# EAGLE design rain-drop-probe-v1.1 (EAGLE 9.6.2)
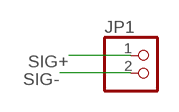
[diagram p0: schematic, sheet 1]

## Parts
JP1  PINHD-1X2  [1X02]

## Nets
SIG+: JP1.1
SIG-: JP1.2

## Library data of the parts
JP1 = pinhead:PINHD-1X2: PIN HEADER

## Board
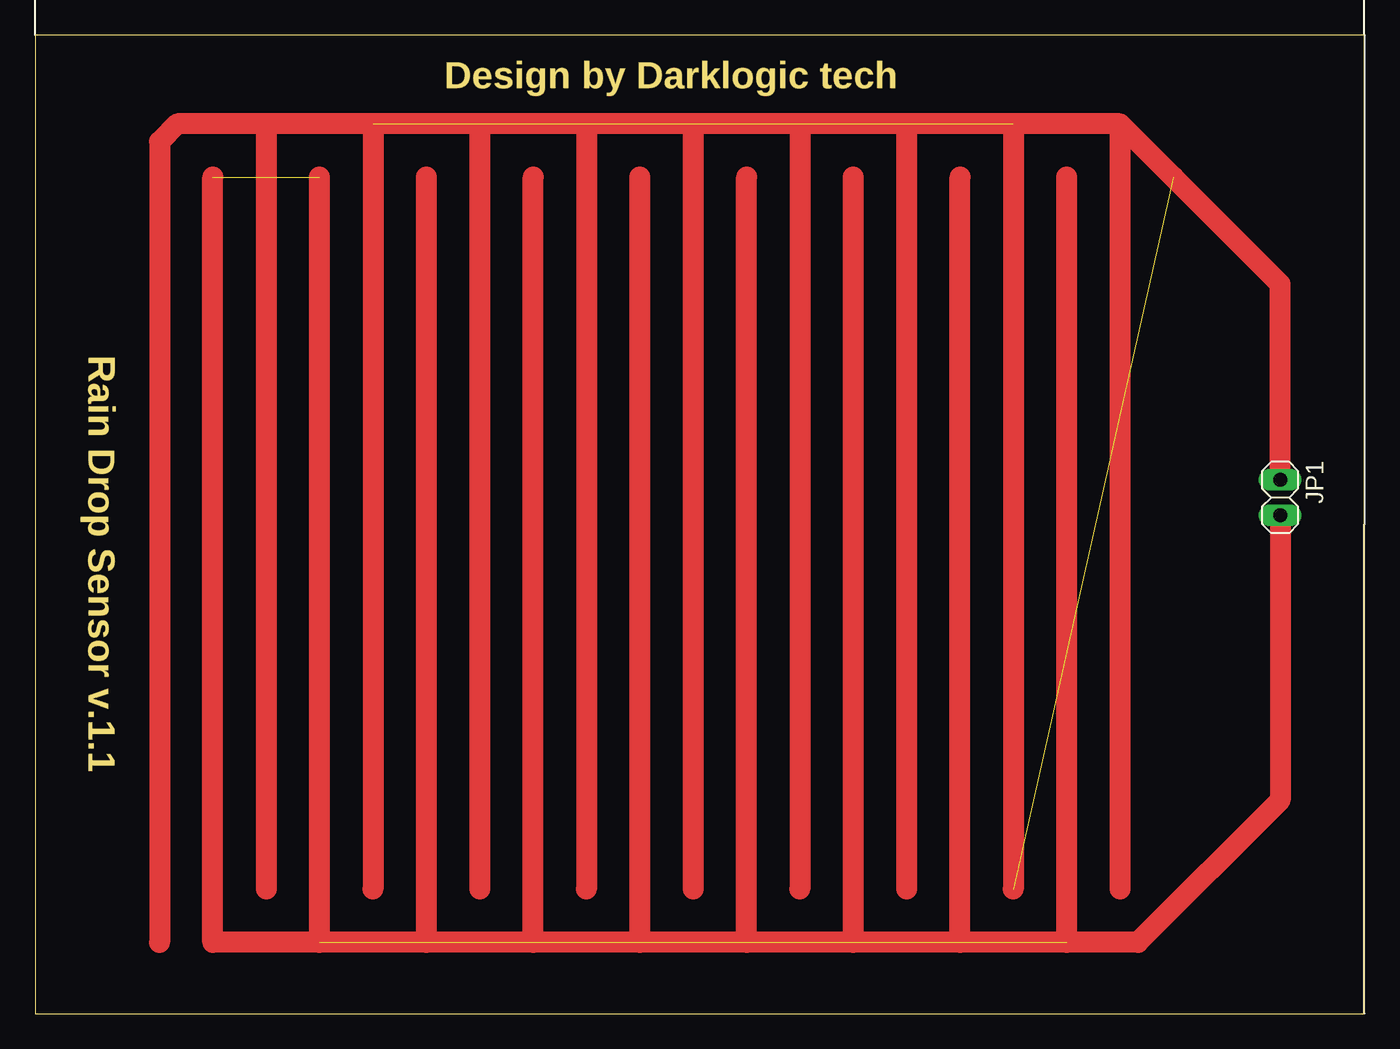
[diagram p1: board, top side]
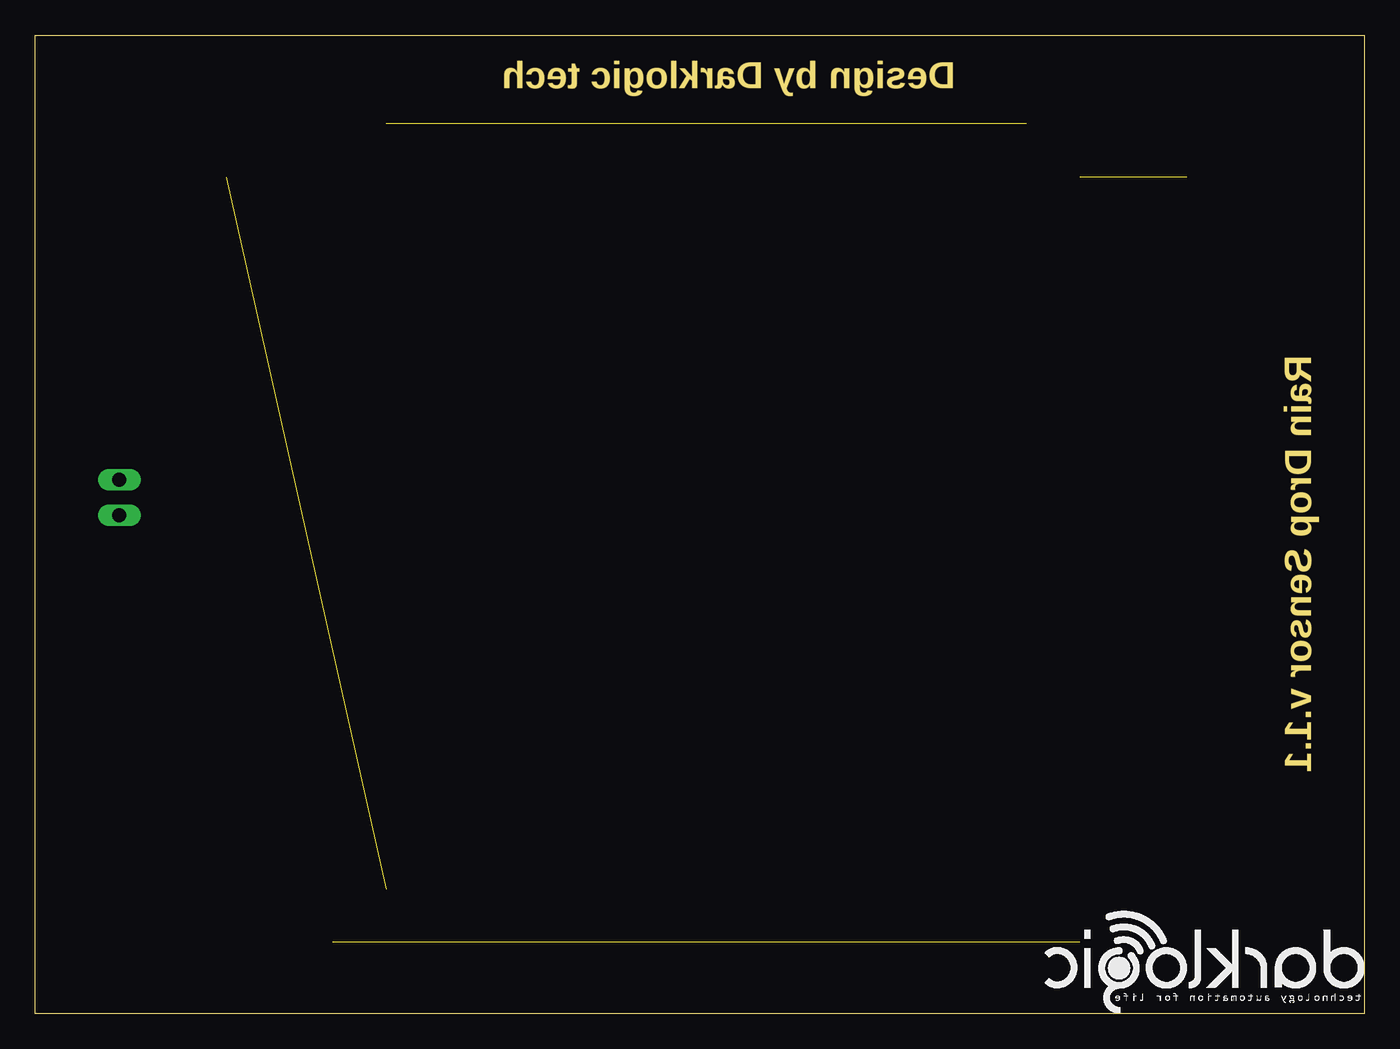
[diagram p2: board, bottom side, seen from below]

Size 94.92 x 69.84 mm. Coordinates in mm from the lower left corner, seen from the top.
Outline: 0,0 94.92,0 94.92,69.84 0,69.84 0,0
Copper layers (1*16): Top 0.035mm / dielectric 1.5mm / Bottom 0.035mm
Design rules "default": minimum track width 6mil, minimum drill 0.35mm, track to track 6mil, track to pad 6mil, pad to pad 6mil, via to via 6mil, smd to smd 6mil, copper to edge 40mil, drill to drill 6mil, minimum pad ring 10mil, minimum via ring 8mil, stop-mask expansion 4mil, vias tented up to drill 0mil, thermal gap 10mil

### Footprints (pad centres in the part's own frame; a part is rotated, then mirrored left to right if it is on the bottom)
1X02 = drill 1.016 long: 1 -1.27,0; 2 1.27,0

### Placement (x,y rotation side)
JP1  88.9,36.83 270 top

### Tracks (layer width: path | path; a pad name or v marks a point on that pad's centre or on a via)
SIG+  (7 unrouted)
  Top 1.5: JP1.1 88.9,52.07 82.55,58.42 | 82.55,58.42 81.28,59.69 | 81.28,59.69 77.47,63.5 | 77.47,63.5 16.51,63.5 | 16.51,63.5 10.16,63.5 8.89,62.23 8.89,5.08 | 16.51,63.5 16.51,8.89 | 24.13,63.5 24.13,8.89 | 31.75,63.5 31.75,8.89 | 39.37,63.5 39.37,8.89 | 46.99,63.5 46.99,8.89 | 54.61,63.5 54.61,8.89 | 62.23,63.5 62.23,8.89 | 69.85,63.5 69.85,8.89 | 77.47,63.5 77.47,8.89 | 82.55,58.42 | 81.28,59.69
SIG-  (8 unrouted)
  Top 1.5: JP1.2 88.9,15.24 78.74,5.08 12.7,5.08 12.7,59.69 | 20.32,5.08 20.32,59.69 | 27.94,5.08 27.94,59.69 | 35.56,5.08 35.56,59.69 | 43.18,5.08 43.18,59.69 | 50.8,5.08 50.8,59.69 | 58.42,5.08 58.42,59.69 | 66.04,5.08 66.04,59.69 | 73.66,5.08 73.66,59.69

### Text on the board
Dimension: Design by Darklogic tech | Rain Drop Sensor v.1.1